# Altium schematic sheet MCU.SchDoc
size A4; SheetNumber: 1; SheetTotal: 4
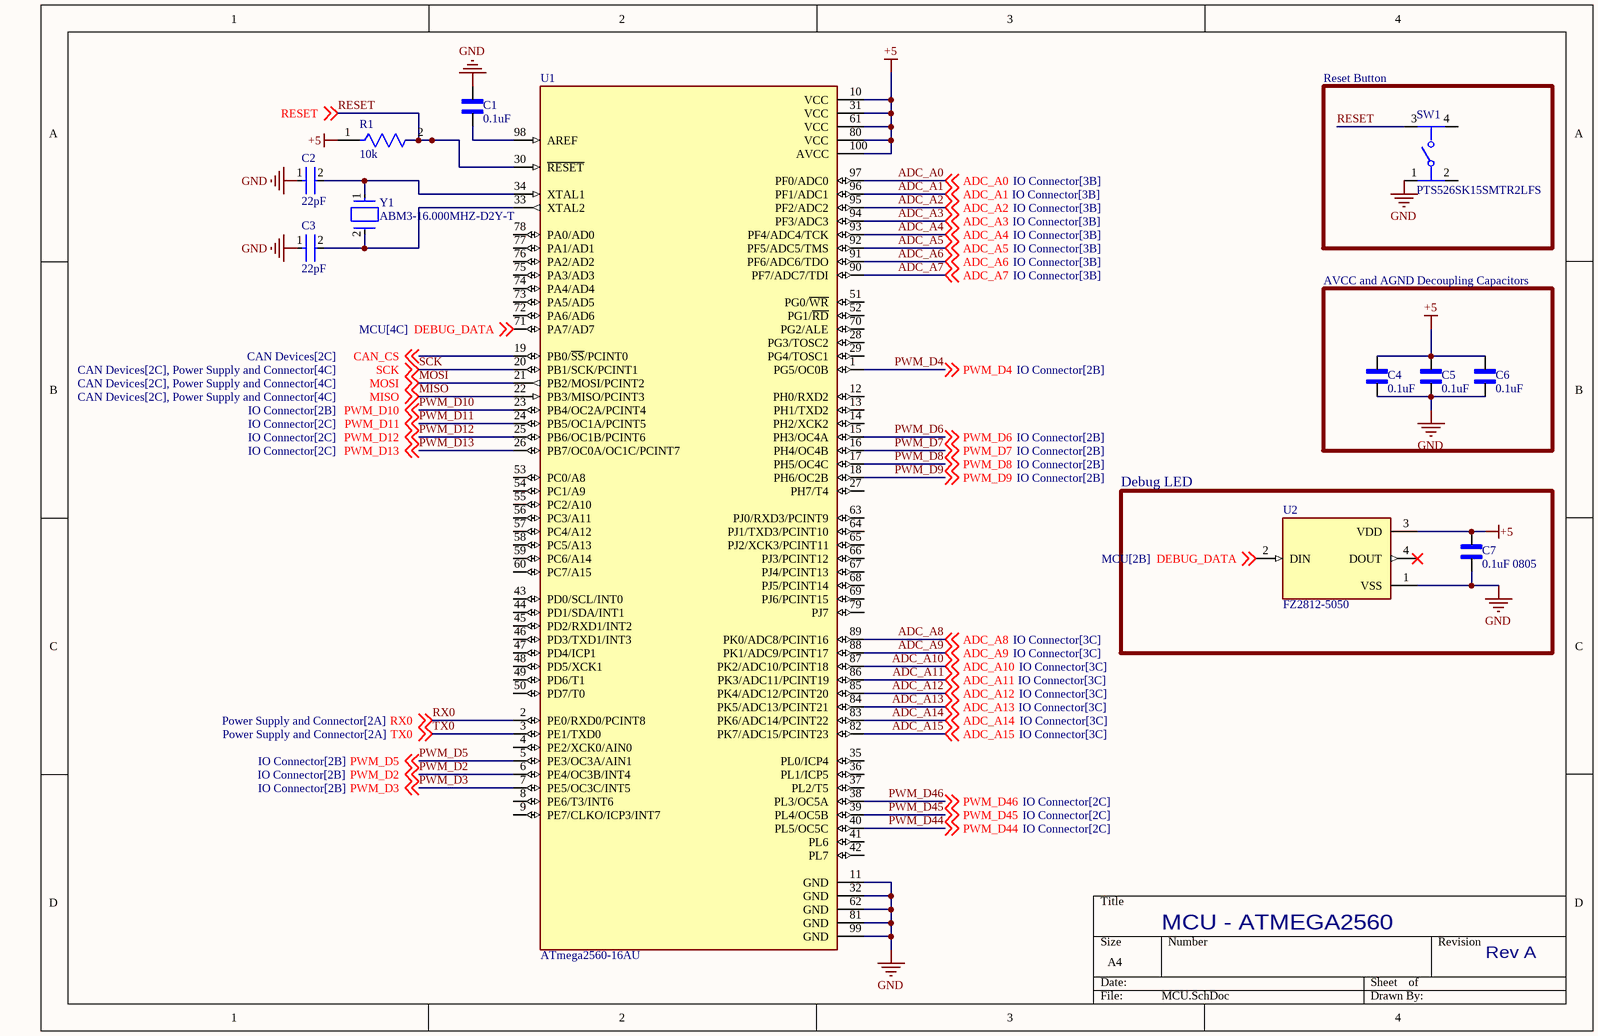
[diagram p0: MCU.SchDoc]

## Parts
C1  0.1uF  [CAPC2012X135N]
C2  22pF  [FP-C0805C-DN-MFG]
C3  22pF  [FP-C0805C-DN-MFG]
C4  0.1uF  [CAPC2012X135N]
C5  0.1uF  [CAPC2012X135N]
C6  0.1uF  [CAPC2012X135N]
C7  0.1uF 0805  [CAPC2012X135N]
R1  10k  [FP-CRCW0805-e3-IPC_A]
SW1  PTS526SK15SMTR2LFS  [FP-PTS526SK15SMTR2LFS-MFG]
U1  ATmega2560-16AU  [QFP50P1600X1600X120-100N]
U2  FZ2812-5050  [LED_FZ2812-5050]
Y1  ABM3-16.000MHZ-D2Y-T  [FP-ABM3-MFG]

## Blocks framed on the sheet
Reset Button: SW1
AVCC and AGND Decoupling Capacitors: C4-C6
Debug LED: C7 U2

## Nets
+5: C4.1 C5.1 C6.1 C7.1 R1.1 U1.10(VCC) U1.31(VCC) U1.61(VCC) U1.80(VCC) U1.100(AVCC) U2.3(VDD)
GND: C1.1 C2.1 C3.1 C4.2 C5.2 C6.2 C7.2 SW1.1 U1.11(GND) U1.32(GND) U1.62(GND) U1.81(GND) U1.99(GND) U2.1(VSS)
ADC_A0: U1.97(PF0/ADC0) ; off-sheet ADC_A0
ADC_A1: U1.96(PF1/ADC1) ; off-sheet ADC_A1
ADC_A2: U1.95(PF2/ADC2) ; off-sheet ADC_A2
ADC_A3: U1.94(PF3/ADC3) ; off-sheet ADC_A3
ADC_A4: U1.93(PF4/ADC4/TCK) ; off-sheet ADC_A4
ADC_A5: U1.92(PF5/ADC5/TMS) ; off-sheet ADC_A5
ADC_A6: U1.91(PF6/ADC6/TDO) ; off-sheet ADC_A6
ADC_A7: U1.90(PF7/ADC7/TDI) ; off-sheet ADC_A7
ADC_A8: U1.89(PK0/ADC8/PCINT16) ; off-sheet ADC_A8
ADC_A9: U1.88(PK1/ADC9/PCINT17) ; off-sheet ADC_A9
ADC_A10: U1.87(PK2/ADC10/PCINT18) ; off-sheet ADC_A10
ADC_A11: U1.86(PK3/ADC11/PCINT19) ; off-sheet ADC_A11
ADC_A12: U1.85(PK4/ADC12/PCINT20) ; off-sheet ADC_A12
ADC_A13: U1.84(PK5/ADC13/PCINT21) ; off-sheet ADC_A13
ADC_A14: U1.83(PK6/ADC14/PCINT22) ; off-sheet ADC_A14
ADC_A15: U1.82(PK7/ADC15/PCINT23) ; off-sheet ADC_A15
CAN_CS: U1.19(PB0/~{SS}/PCINT0) ; off-sheet CAN_CS
DEBUG_DATA: U1.71(PA7/AD7) U2.2(DIN) ; off-sheet DEBUG_DATA
MISO: U1.22(PB3/MISO/PCINT3) ; off-sheet MISO
MOSI: U1.21(PB2/MOSI/PCINT2) ; off-sheet MOSI
PWM_D2: U1.6(PE4/OC3B/INT4) ; off-sheet PWM_D2
PWM_D3: U1.7(PE5/OC3C/INT5) ; off-sheet PWM_D3
PWM_D4: U1.1(PG5/OC0B) ; off-sheet PWM_D4
PWM_D5: U1.5(PE3/OC3A/AIN1) ; off-sheet PWM_D5
PWM_D6: U1.15(PH3/OC4A) ; off-sheet PWM_D6
PWM_D7: U1.16(PH4/OC4B) ; off-sheet PWM_D7
PWM_D8: U1.17(PH5/OC4C) ; off-sheet PWM_D8
PWM_D9: U1.18(PH6/OC2B) ; off-sheet PWM_D9
PWM_D10: U1.23(PB4/OC2A/PCINT4) ; off-sheet PWM_D10
PWM_D11: U1.24(PB5/OC1A/PCINT5) ; off-sheet PWM_D11
PWM_D12: U1.25(PB6/OC1B/PCINT6) ; off-sheet PWM_D12
PWM_D13: U1.26(PB7/OC0A/OC1C/PCINT7) ; off-sheet PWM_D13
PWM_D44: U1.40(PL5/OC5C) ; off-sheet PWM_D44
PWM_D45: U1.39(PL4/OC5B) ; off-sheet PWM_D45
PWM_D46: U1.38(PL3/OC5A) ; off-sheet PWM_D46
RESET: R1.2 SW1.3 U1.30(~{RESET}) ; off-sheet RESET
RX0: U1.2(PE0/RXD0/PCINT8) ; off-sheet RX0
SCK: U1.20(PB1/SCK/PCINT1) ; off-sheet SCK
TX0: U1.3(PE1/TXD0) ; off-sheet TX0
NetC1_2: C1.2 U1.98(AREF)
NetC2_2: C2.2 U1.34(XTAL1) Y1.1
NetC3_2: C3.2 U1.33(XTAL2) Y1.2

Not connected (* = marked no-connect by the designer): SW1 2 4; U1 4(PE2/XCK0/AIN0) 8(PE6/T3/INT6) 9(PE7/CLKO/ICP3/INT7) 12(PH0/RXD2) 13(PH1/TXD2) 14(PH2/XCK2) 27(PH7/T4) 28(PG3/TOSC2) 29(PG4/TOSC1) 35(PL0/ICP4) 36(PL1/ICP5) 37(PL2/T5) 41(PL6) 42(PL7) 43(PD0/SCL/INT0) 44(PD1/SDA/INT1) 45(PD2/RXD1/INT2) 46(PD3/TXD1/INT3) 47(PD4/ICP1) 48(PD5/XCK1) 49(PD6/T1) 50(PD7/T0) 51(PG0/~{WR}) 52(PG1/~{RD}) 53(PC0/A8) 54(PC1/A9) 55(PC2/A10) 56(PC3/A11) 57(PC4/A12) 58(PC5/A13) 59(PC6/A14) 60(PC7/A15) 63(PJ0/RXD3/PCINT9) 64(PJ1/TXD3/PCINT10) 65(PJ2/XCK3/PCINT11) 66(PJ3/PCINT12) 67(PJ4/PCINT13) 68(PJ5/PCINT14) 69(PJ6/PCINT15) 70(PG2/ALE) 72(PA6/AD6) 73(PA5/AD5) 74(PA4/AD4) 75(PA3/AD3) 76(PA2/AD2) 77(PA1/AD1) 78(PA0/AD0) 79(PJ7); U2 4(DOUT)*

## Notes on the sheet
- MCU - ATMEGA2560
- Rev A

## Library data of the parts
C1 C4-C7 = GCM21BR71H104KA37L: CAP, MLCC, X7R, 0.1UF, 50V, 0805; MF: {'manufacturer': u'Murata'}; Package: None; Price: None; Value: *; MP: GCM21BR71H104KA37L; Availability: Unavailable
C2 C3 = CMP-2007-00448-2: CAP CER 22PF 100V 5% NP0 0805; Manufacturer Part Number: C0805C220J1GACTU; Manufacturer: KEMET; Material: Ceramic; Temperature Coefficient: 30ppm/°C; Tolerance: 0.05; Temperature Characteristic: C0G; Value: 22 pF; RoHS: TRUE; ComponentLink2URL: https://content.kemet.com/datasheets/KEM_C1003_C0G_SMD.pdf; Capacitance: 22 pF; Mouser Description: Multilayer Ceramic Capacitor, C Series, 22 Pf, - 5%, C0g / Np0, 100 V, 0805 [2012 Metric] Rohs Compliant: Yes; Digikey Description: CAP CER 22PF 100V 5% NP0 0805; Octopart: https://octopart.com/c0805c220j1gactu-kemet-3791395; Device Class L3: Ceramic Capacitors; Device Class L2: Capacitors; Voltage Rating: 100 V; Temperature Range Low: -55°C; Ipc Land Pattern Name: CAPC200125X78; Lead Free: Yes; ComponentLink2Description: Datasheet; Category: Cap; Temperature: -55°C to +125°C; Package: C0805C-DN; Device Class L1: Passive Components; Temperature Range High: +125°C; Height: 0.88mm; Automotive: No
R1 = CMP-2001-04908-2: RES Thick Film, 10kΩ, 1%, 0.125W, 100ppm/°C, 0805; Resistance: 10kR; Voltage Rating (DC): 150V; Power Rating: 125mW; Weight: 0.000194oz; Package Quantity: 5000; Military Standard: Not; Max Operating Temperature: 155°C; Temperature Coefficient: 100ppm/°C; Contact Plating: Tin; Width: 1.25mm; Height: 0.45mm; Radiation Hardening: No; Tolerance: 1%; Min Operating Temperature: -55°C; Voltage Rating: 150V; Length: 2mm; Depth: 1.25mm; Termination: SMD/SMT; Packaging: Tape and Reel; Case/Package: 0805; Case Code (Metric): 2012; Lead Free: Lead Free; Case Code (Imperial): 0805; Composition: Thick Film
SW1 = CMP-10040-000013-1: TACT 5.2 X 5.2, 1.5 MM H, 260GF,; Manufacturer: C&K; Operating Force: 250gf; Throw Configuration: SPST-NO; Contact Current Rating: 50mA; Standoff Height: 0mm; Contact Resistance: 100mΩ; Voltage Rating Dc: 12V; Electromechanical Life: 200000Cycles; Device Class L3: Tactile Switches; Device Class L2: Switches; Temperature: -20°C to +70°C; Temperature Range Low: -20°C; Package: PTS526SK15SMTR2LFS; Temperature Range High: +70°C; ComponentLink2Description: Datasheet; Device Class L1: Electromechanical; Height: 1.65mm; Digikey Description: TACT 5.2 X 5.2, 1.5 MM H, 260GF,; Category: Switch; RoHS: TRUE; Automotive: No; Lead Free: Yes; Manufacturer Part Number: PTS526SK15SMTR2LFS; Octopart: https://octopart.com/pts526+sk15+smtr2+lfs-c%26k+components-100617999; ComponentLink2URL: https://www.ckswitches.com/media/2780/pts526.pdf
U1 = ATmega2560-16AU: MF: {'manufacturer': u'Microchip Technology'}; Package: None; Price: None; Value: *; MP: ATmega2560-16AU; Availability: Unavailable
U2 = FZ2812-5050: MF: {'manufacturer': u'Feztek'}; Package: None; Price: None; Value: *; MP: FZ2812-5050; Availability: Unavailable
Y1 = CMP-27762-004490-1: Crystal 16MHz ±20ppm 18pF SMD-2 5mm x 3.2mm; Frequency Stability: 30ppm; Series Resistance: 40R; Tolerance: 20ppm; Frequency Tolerance: 20ppm; Load Capacitance: 18pF; Resistor Type: Ceramic; Termination: SMD/SMT; Width: 0.126inch; Mount: Surface Mount; RoHS Compliant: Yes; Package Quantity: 1000; Height: 0.051inch; Length: 0.197inch; Frequency: 16MHz; Operating Frequency: 16 MHz; Packaging: Tape and Reel; Max Operating Temperature: 85°C; Series: ABM3; Case/Package: SMD/SMT; Lead Free: Lead Free; ESR (Equivalent Series Resistance): 40R; Number of Pins: 2; Min Operating Temperature: -40°C